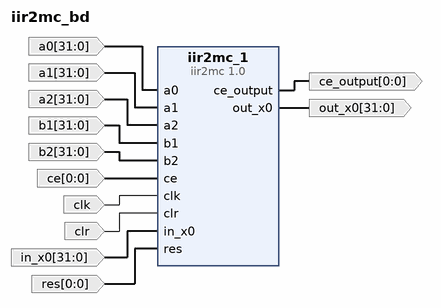
[diagram p0: block diagram of the top level]
# Vivado block design iir2mc_bd, xc7z030sbg485-1, Vivado 2023.2
create_bd_design iir2mc_bd

create_bd_port -dir I -from 31 -to 0 -type data a0
create_bd_port -dir I -from 31 -to 0 -type data a1
create_bd_port -dir I -from 31 -to 0 -type data a2
create_bd_port -dir I -from 31 -to 0 -type data b1
create_bd_port -dir I -from 31 -to 0 -type data b2
create_bd_port -dir I -from 0 -to 0 -type ce ce
create_bd_port -dir O -from 0 -to 0 -type data ce_output
create_bd_port -dir I -type clk clk
create_bd_port -dir I -type data clr
create_bd_port -dir I -from 31 -to 0 -type data in_x0
create_bd_port -dir O -from 31 -to 0 -type data out_x0
create_bd_port -dir I -from 0 -to 0 -type data res

create_bd_cell -type ip -vlnv MaxIV:Panda_ModelComp:iir2mc:1.0 iir2mc_1

# ---- connections ----

connect_bd_net -net a0_1 [get_bd_ports a0] [get_bd_pins iir2mc_1/a0]
connect_bd_net -net a1_1 [get_bd_ports a1] [get_bd_pins iir2mc_1/a1]
connect_bd_net -net a2_1 [get_bd_ports a2] [get_bd_pins iir2mc_1/a2]
connect_bd_net -net b1_1 [get_bd_ports b1] [get_bd_pins iir2mc_1/b1]
connect_bd_net -net b2_1 [get_bd_ports b2] [get_bd_pins iir2mc_1/b2]
connect_bd_net [get_bd_ports ce] [get_bd_pins iir2mc_1/ce]
connect_bd_net [get_bd_ports clk] [get_bd_pins iir2mc_1/clk]
connect_bd_net [get_bd_ports clr] [get_bd_pins iir2mc_1/clr]
connect_bd_net [get_bd_pins iir2mc_1/ce_output] [get_bd_ports ce_output]
connect_bd_net [get_bd_pins iir2mc_1/out_x0] [get_bd_ports out_x0]
connect_bd_net -net in_x0_1 [get_bd_ports in_x0] [get_bd_pins iir2mc_1/in_x0]
connect_bd_net [get_bd_ports res] [get_bd_pins iir2mc_1/res]

validate_bd_design
save_bd_design
